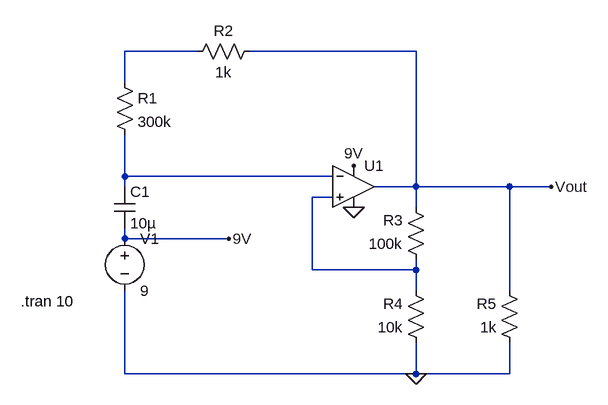
[diagram p0: schematic Comparator.asc]
Comparator.asc, the LTspice schematic file:
Version 4
SHEET 1 880 680
WIRE -288 -112 -400 -112
WIRE 48 -112 -208 -112
WIRE -400 -64 -400 -112
WIRE -400 80 -400 16
WIRE -80 80 -400 80
WIRE -400 96 -400 80
WIRE 48 96 48 -112
WIRE 48 96 -16 96
WIRE 192 96 48 96
WIRE 256 96 192 96
WIRE -80 112 -112 112
WIRE 48 128 48 96
WIRE -400 176 -400 160
WIRE -240 176 -400 176
WIRE -112 224 -112 112
WIRE 48 224 48 208
WIRE 48 224 -112 224
WIRE 48 256 48 224
WIRE 192 256 192 96
WIRE -400 384 -400 256
WIRE 48 384 48 336
WIRE 48 384 -400 384
WIRE 192 384 192 336
WIRE 192 384 48 384
FLAG -48 128 0
FLAG 48 384 0
FLAG -240 176 9V
FLAG -48 64 9V
FLAG 256 96 Vout
SYMBOL voltage -400 160 R0
SYMATTR InstName V1
SYMATTR Value 9
SYMBOL OpAmps/UniversalOpamp -48 96 R0
SYMATTR InstName U1
SYMBOL cap -416 96 R0
SYMATTR InstName C1
SYMATTR Value 10µ
SYMBOL res -416 -80 R0
SYMATTR InstName R1
SYMATTR Value 300k
SYMBOL res -192 -128 R90
WINDOW 0 0 56 VBottom 2
WINDOW 3 32 56 VTop 2
SYMATTR InstName R2
SYMATTR Value 1k
SYMBOL res 64 224 R180
WINDOW 0 36 76 Left 2
WINDOW 3 36 40 Left 2
SYMATTR InstName R3
SYMATTR Value 100k
SYMBOL res 64 352 R180
WINDOW 0 36 76 Left 2
WINDOW 3 36 40 Left 2
SYMATTR InstName R4
SYMATTR Value 10k
SYMBOL res 208 352 R180
WINDOW 0 36 76 Left 2
WINDOW 3 36 40 Left 2
SYMATTR InstName R5
SYMATTR Value 1k
TEXT -560 272 Left 2 !.tran 10

The netlist it stands for:
* Comparator.asc
V1 9V 0 9
XU1 N003 N002 9V 0 Vout level1 Avol=1Meg GBW=10Meg Vos=0 En=0 Enk=0 In=0 Ink=0 Rin=500Meg  ; pins In+ In- V+ V- OUT
C1 N002 9V 10µ
R1 N001 N002 300k
R2 Vout N001 1k
R3 N003 Vout 100k
R4 0 N003 10k
R5 0 Vout 1k
.tran 10
.lib UniversalOpAmp1.lib
.backanno
.end